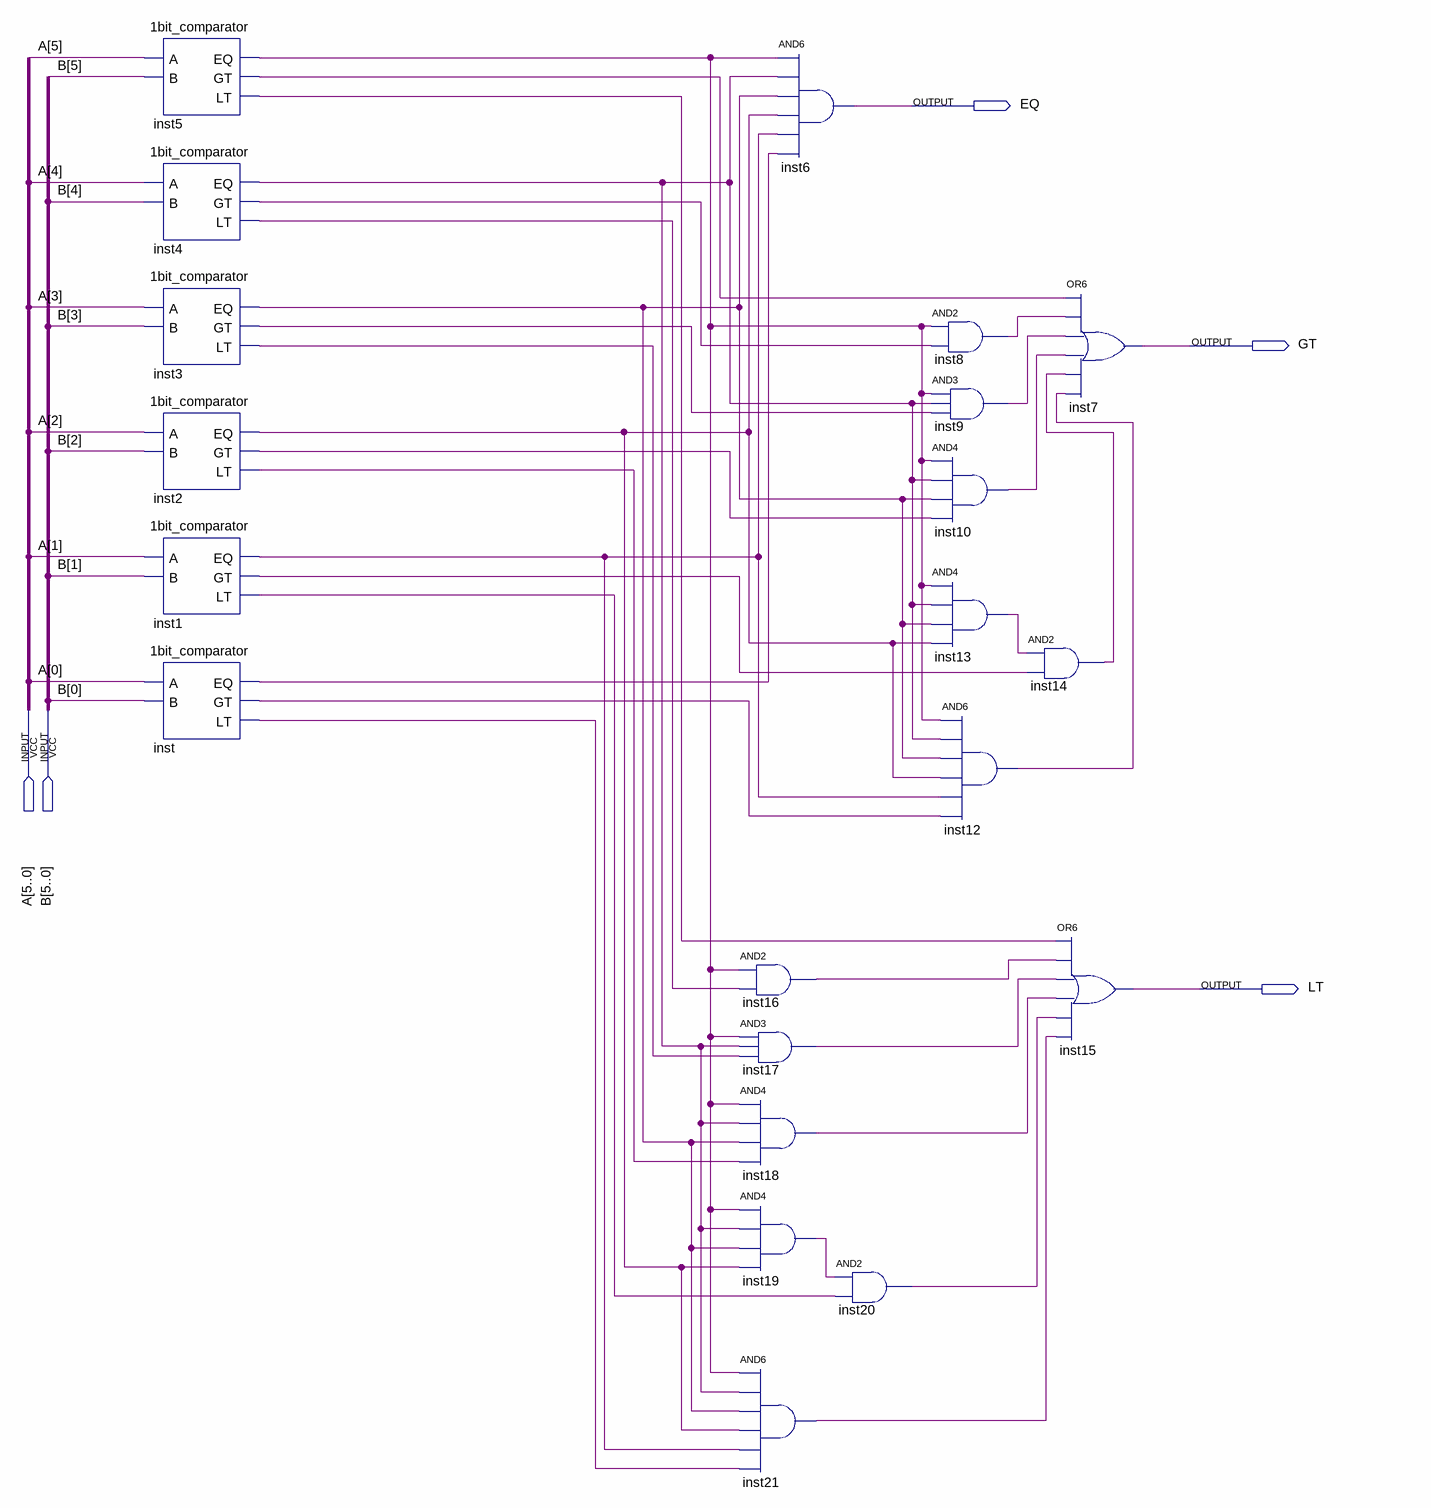
[diagram p0: schematic sheet]
// Quartus schematic comparator.bdf as structural Verilog: 21 symbols, 5 pins
module comparator (
  input  [5:0] A,
  input  [5:0] B,
  output EQ,
  output GT,
  output LT
);

  wire inst1_eq, inst1_gt, inst1_lt, inst2_eq, inst2_gt, inst2_lt, inst3_eq, inst3_gt, inst3_lt, inst4_eq,
       inst4_gt, inst4_lt, inst5_eq, inst5_gt, inst5_lt, inst8_out, inst9_out, inst10_out, inst12_out,
       inst13_out, inst14_out, inst16_out, inst17_out, inst18_out, inst19_out, inst20_out, inst21_out,
       inst_eq, inst_gt, inst_lt;

  \1bit_comparator  inst5 (.A(A[5]), .B(B[5]), .EQ(inst5_eq), .GT(inst5_gt), .LT(inst5_lt));
  \1bit_comparator  inst4 (.A(A[4]), .B(B[4]), .EQ(inst4_eq), .GT(inst4_gt), .LT(inst4_lt));
  \1bit_comparator  inst3 (.A(A[3]), .B(B[3]), .EQ(inst3_eq), .GT(inst3_gt), .LT(inst3_lt));
  \1bit_comparator  inst2 (.A(A[2]), .B(B[2]), .EQ(inst2_eq), .GT(inst2_gt), .LT(inst2_lt));
  \1bit_comparator  inst1 (.A(A[1]), .B(B[1]), .EQ(inst1_eq), .GT(inst1_gt), .LT(inst1_lt));
  \1bit_comparator  inst (.A(A[0]), .B(B[0]), .EQ(inst_eq), .GT(inst_gt), .LT(inst_lt));
  and inst16 (inst16_out, inst5_eq, inst4_lt);
  and inst17 (inst17_out, inst5_eq, inst4_eq, inst3_lt);
  and inst18 (inst18_out, inst5_eq, inst4_eq, inst3_eq, inst2_lt);
  and inst19 (inst19_out, inst5_eq, inst4_eq, inst3_eq, inst2_eq);
  and inst21 (inst21_out, inst5_eq, inst4_eq, inst3_eq, inst2_eq, inst1_eq, inst_lt);
  and inst6 (EQ, inst5_eq, inst4_eq, inst3_eq, inst2_eq, inst1_eq, inst_eq);
  and inst20 (inst20_out, inst19_out, inst1_lt);
  and inst8 (inst8_out, inst5_eq, inst4_gt);
  and inst9 (inst9_out, inst5_eq, inst4_eq, inst3_gt);
  and inst10 (inst10_out, inst5_eq, inst4_eq, inst3_eq, inst2_gt);
  and inst13 (inst13_out, inst5_eq, inst4_eq, inst3_eq, inst2_eq);
  and inst12 (inst12_out, inst5_eq, inst4_eq, inst3_eq, inst2_eq, inst1_eq, inst_gt);
  or inst7 (GT, inst5_gt, inst8_out, inst9_out, inst10_out, inst14_out, inst12_out);
  and inst14 (inst14_out, inst13_out, inst1_gt);
  or inst15 (LT, inst5_lt, inst16_out, inst17_out, inst18_out, inst20_out, inst21_out);
endmodule
